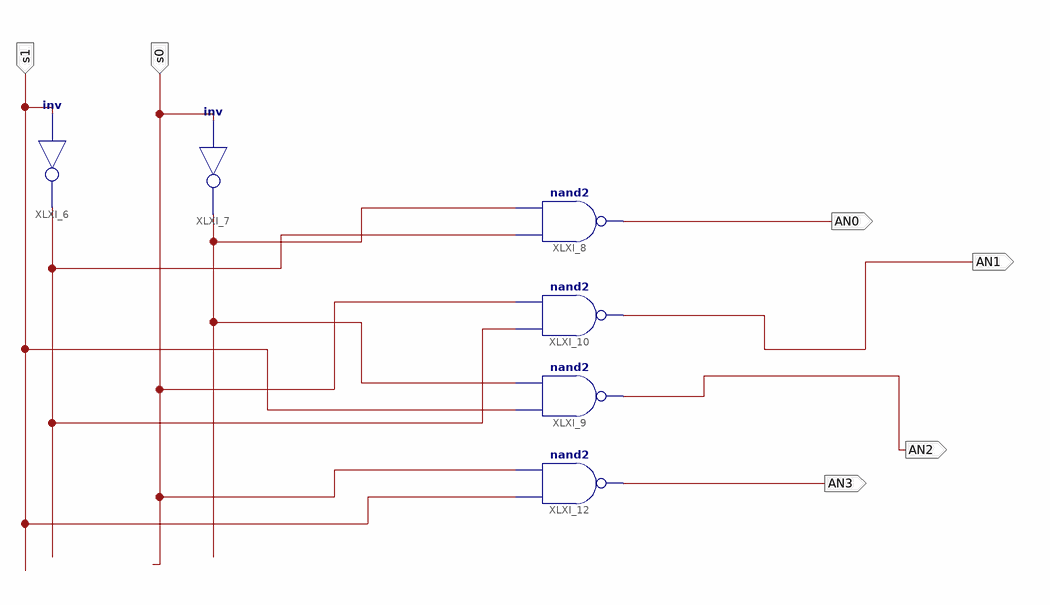
[diagram p0: schematic sheet 1]
// Xilinx ISE schematic four_bit_demux.sch (spartan3e) as structural Verilog: 6 symbols, 6 ports
module four_bit_demux (
  input  s1,
  input  s0,
  output AN3,
  output AN0,
  output AN1,
  output AN2
);

  wire XLXN_13, XLXN_14;

  not XLXI_6 (XLXN_14, s1);
  not XLXI_7 (XLXN_13, s0);
  nand XLXI_8 (AN0, XLXN_14, XLXN_13);
  nand XLXI_9 (AN2, s1, XLXN_13);
  nand XLXI_10 (AN1, XLXN_14, s0);
  nand XLXI_12 (AN3, s1, s0);
endmodule
